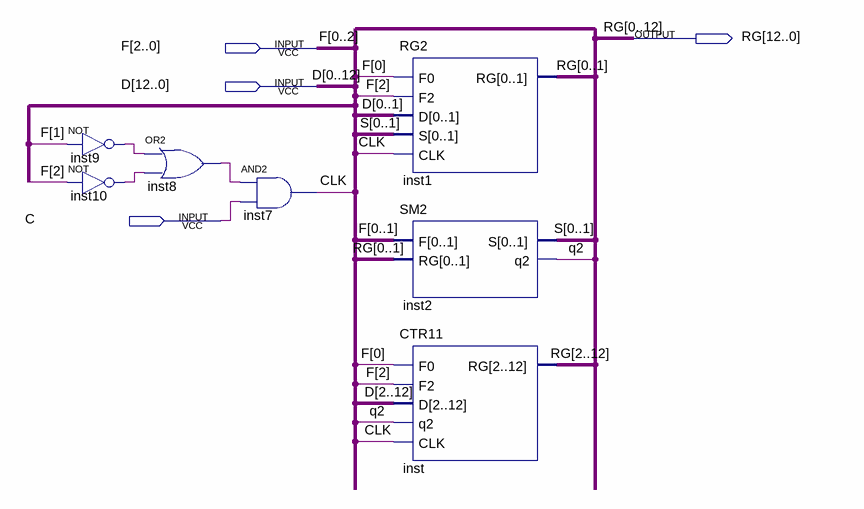
[diagram p0: schematic sheet]
// Quartus schematic Lab1_blocked.bdf as structural Verilog: 7 symbols, 4 pins
module Lab1_blocked (
  input  [2:0] F,
  input  [12:0] D,
  input  C,
  output [12:0] RG
);

  wire CLK, inst8_out, inst9_out, inst10_out, q2;
  wire [1:0] S;

  not inst9 (inst9_out, F[1]);
  not inst10 (inst10_out, F[2]);
  or inst8 (inst8_out, inst9_out, inst10_out);
  and inst7 (CLK, inst8_out, C);
  RG2 inst1 (.F0(F[0]), .F2(F[2]), .D({D[0], D[1]}), .S({S[0], S[1]}), .CLK(CLK), .RG({RG[0], RG[1]}));
  SM2 inst2 (.F({F[0], F[1]}), .RG({RG[0], RG[1]}), .S({S[0], S[1]}), .q2(q2));
  CTR11 inst (
    .F0(F[0]), .F2(F[2]), .D({D[2], D[3], D[4], D[5], D[6], D[7], D[8], D[9], D[10], D[11], D[12]}), .q2(q2),
    .CLK(CLK), .RG({RG[2], RG[3], RG[4], RG[5], RG[6], RG[7], RG[8], RG[9], RG[10], RG[11], RG[12]}));
endmodule
